# EAGLE design IN-14 Clock (EAGLE 8.1.0)
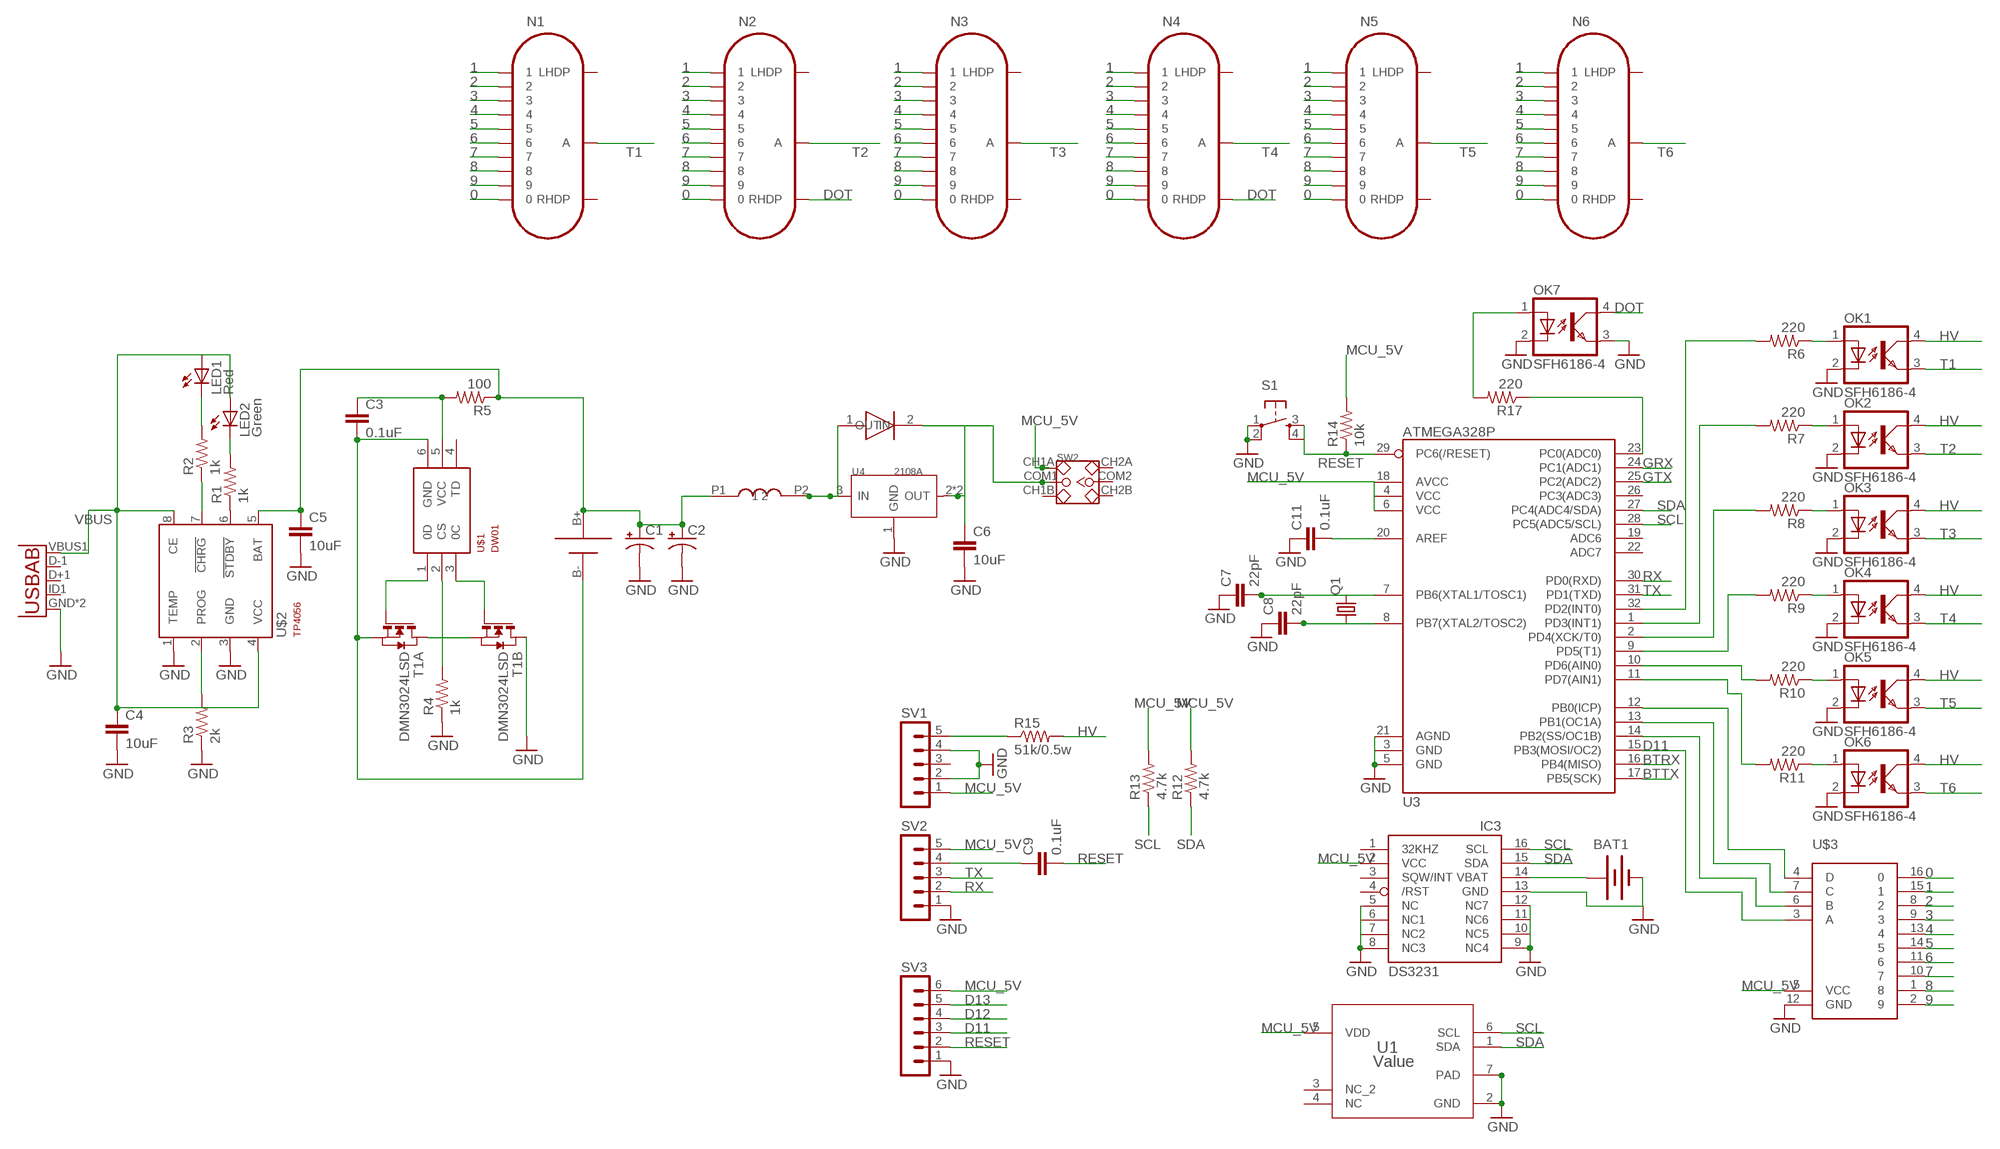
[diagram p0: schematic, sheet 1, part 1 of 2]
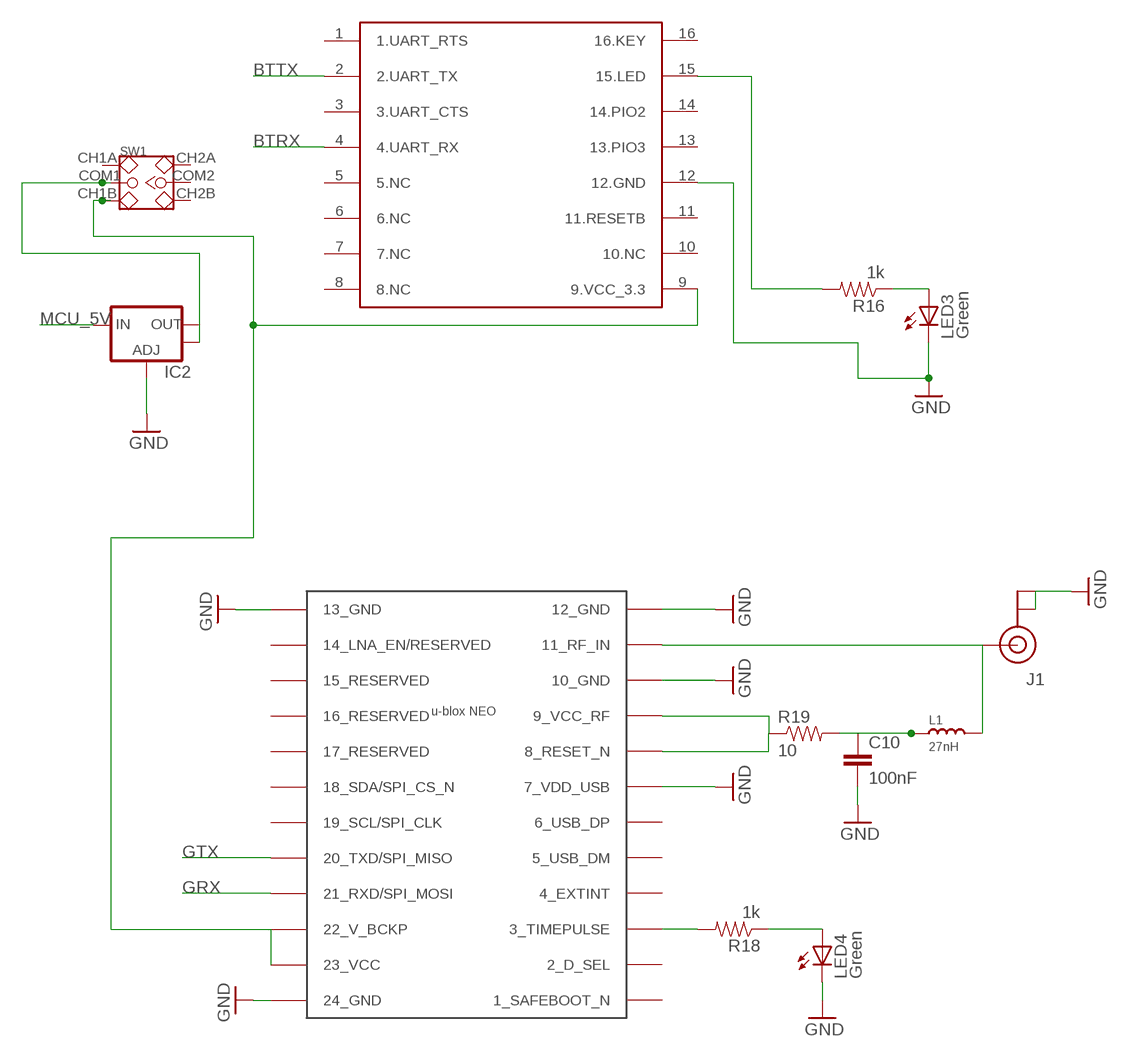
[diagram p1: schematic, sheet 1, part 2 of 2]

## Parts
BAT1  BATTERY20PTH  [BATTCOM_20MM_PTH]
C1  CAP_POLF80  [NIPPON_F80]
C2  CAP_POLF80  [NIPPON_F80]
C3  0.1uF  0.1UF-25V-5%(0603)  [0603-CAP]
C4  10uF  0.1UF-25V-5%(0603)  [0603-CAP]
C5  10uF  0.1UF-25V-5%(0603)  [0603-CAP]
C6  10uF  0.1UF-25V-5%(0603)  [0603-CAP]
C7  22pF  0.1UF-25V-5%(0603)  [0603-CAP]
C8  22pF  0.1UF-25V-5%(0603)  [0603-CAP]
C9  0.1uF  0.1UF-25V-5%(0603)  [0603-CAP]
C10  100nF  .22UF-CER  [0402-CAP]
C11  0.1uF  0.1UF-25V-5%(0603)  [0603-CAP]
IC2  V_REG_LM1117SOT223  [SOT223]
IC3  DS3231/SO  [SO16W]
J1  U.FL  [U.FL]
L1  27nH  SMD-FERRITE-BEAD-2500R-50MA(0603)  [L0603]
LED1  Red  LEDCHIP-LED0805  [CHIP-LED0805]
LED2  Green  LEDCHIP-LED0805  [CHIP-LED0805]
LED3  Green  LEDCHIP-LED0805  [CHIP-LED0805]
LED4  Green  LEDCHIP-LED0805  [CHIP-LED0805]
N1  IN-14  [IN-14]
N2  IN-14  [IN-14]
N3  IN-14  [IN-14]
N4  IN-14  [IN-14]
N5  IN-14  [IN-14]
N6  IN-14  [IN-14]
OK1  SFH6186-4  [SMD4-7]
OK2  SFH6186-4  [SMD4-7]
OK3  SFH6186-4  [SMD4-7]
OK4  SFH6186-4  [SMD4-7]
OK5  SFH6186-4  [SMD4-7]
OK6  SFH6186-4  [SMD4-7]
OK7  SFH6186-4  [SMD4-7]
Q1  CRYSTALSM49  [SM49]
R1  1k  1.2MOHMS-1/10W-1%(0603)  [0603-RES]
R2  1k  1.2MOHMS-1/10W-1%(0603)  [0603-RES]
R3  2k  1.2MOHMS-1/10W-1%(0603)  [0603-RES]
R4  1k  1.2MOHMS-1/10W-1%(0603)  [0603-RES]
R5  100  1.2MOHMS-1/10W-1%(0603)  [0603-RES]
R6  220  1.2MOHMS-1/10W-1%(0603)  [0603-RES]
R7  220  1.2MOHMS-1/10W-1%(0603)  [0603-RES]
R8  220  1.2MOHMS-1/10W-1%(0603)  [0603-RES]
R9  220  1.2MOHMS-1/10W-1%(0603)  [0603-RES]
R10  220  1.2MOHMS-1/10W-1%(0603)  [0603-RES]
R11  220  1.2MOHMS-1/10W-1%(0603)  [0603-RES]
R12  4.7k  1.2MOHMS-1/10W-1%(0603)  [0603-RES]
R13  4.7k  1.2MOHMS-1/10W-1%(0603)  [0603-RES]
R14  10k  1.2MOHMS-1/10W-1%(0603)  [0603-RES]
R15  51k/0.5w  R-US_0207/12  [0207/12]
R16  1k  1.2MOHMS-1/10W-1%(0603)  [0603-RES]
R17  220  1.2MOHMS-1/10W-1%(0603)  [0603-RES]
R18  1k  1.2MOHMS-1/10W-1%(0603)  [0603-RES]
R19  10  RESISTOR0603  [0603-RES]
S1  TAC_SWITCHSMD  [TACTILE_SWITCH_SMD]
SV1  MA05-1  [MA05-1]
SV2  MA05-1  [MA05-1]
SV3  MA06-1  [MA06-1]
SW1  SMD-TOGGLE-SWITCH-2CH(2X3P-7X3.5MM)  [SW6-2.54-SMD-7.0X3.5X1.5MM]
SW2  SMD-TOGGLE-SWITCH-2CH(2X3P-7X3.5MM)  [SW6-2.54-SMD-7.0X3.5X1.5MM]
T1  DMN3024LSD  [TSSOP-8]
U1  Value  HDC1080DMBR  [DMB0006A]
U2  USB""  [USB-MICRO-SMD]
U3  ATMEGA328P  ATMEGA328_SMT  [TQFP32-08]
U4  2108A  PMIC-CJA1117B-3.3(SOT-89)  [SOT-89]
U$1  DW01  [SOT23-6]
U$2  TP4056  [SOT23-8]
U$3  K155ID1  [DIL16-KIT]
U$5  22uH  CD54  [CD54]
U$6  SMA-SS34  [SMA-SS34]
U$7  18650SMD  [18650SMD]
U$8  NEO-M8  [NEO-M8]
U$9  HM-13  [HM-13]

## Nets
0: N1.0 N2.0 N3.0 N4.0 N5.0 N6.0 U$3.16
1: N1.1 N2.1 N3.1 N4.1 N5.1 N6.1 U$3.15
2: N1.2 N2.2 N3.2 N4.2 N5.2 N6.2 U$3.8
3: N1.3 N2.3 N3.3 N4.3 N5.3 N6.3 U$3.9
4: N1.4 N2.4 N3.4 N4.4 N5.4 N6.4 U$3.13
5: N1.5 N2.5 N3.5 N4.5 N5.5 N6.5 U$3.14
6: N1.6 N2.6 N3.6 N4.6 N5.6 N6.6 U$3.11
7: N1.7 N2.7 N3.7 N4.7 N5.7 N6.7 U$3.10
8: N1.8 N2.8 N3.8 N4.8 N5.8 N6.8 U$3.1
9: N1.9 N2.9 N3.9 N4.9 N5.9 N6.9 U$3.2
BTRX: U3.16(PB4(MISO)) U$9.4(4.UART_RX)
BTTX: U3.17(PB5(SCK)) U$9.2(2.UART_TX)
D11: SV3.3 U3.15(PB3(MOSI/OC2)) U$3.3(A)
D12: SV3.4
D13: SV3.5
DOT: N2.RHDP N4.RHDP OK7.4(COL)
GND: BAT1.2(-) C1.- C2.- C4.2 C5.2 C6.2 C7.1 C8.1 C10.2 C11.1 IC2.1(ADJ) IC3.5(NC) IC3.6(NC1) IC3.7(NC2) IC3.8(NC3) IC3.9(NC4) IC3.10(NC5) IC3.11(NC6) IC3.12(NC7) IC3.13(GND) J1.P$1(GND) J1.P$2(GND) LED3.C LED4.C OK1.2(C) OK2.2(C) OK3.2(C) OK4.2(C) OK5.2(C) OK6.2(C) OK7.2(C) OK7.3(EMIT) R3.1 R4.1 S1.1 S1.2 SV1.2 SV1.4 SV2.1 SV3.1 T1.8(B:D) U1.2(GND) U1.7(PAD) U2.GND U2.GND1(GND) U3.3(GND) U3.5(GND) U3.21(AGND) U4.1(GND) U$2.1(TEMP) U$2.3(GND) U$3.12(GND) U$8.7(7_VDD_USB) U$8.10(10_GND) U$8.12(12_GND) U$8.13(13_GND) U$8.24(24_GND) U$9.12(12.GND)
GRX: U3.24(PC1(ADC1)) U$8.21(21_RXD/SPI_MOSI)
GTX: U3.25(PC2(ADC2)) U$8.20(20_TXD/SPI_MISO)
HV: OK1.4(COL) OK2.4(COL) OK3.4(COL) OK4.4(COL) OK5.4(COL) OK6.4(COL) R15.2
MCU_5V: IC2.3(IN) IC3.2(VCC) R12.2 R13.2 R14.2 SV1.1 SV2.5 SV3.6 SW2.CH1A U1.5(VDD) U3.4(VCC) U3.6(VCC) U3.18(AVCC) U$3.5(VCC)
N$1: LED2.C R1.2
N$2: R1.1 U$2.6(!STDBY)
N$3: LED1.C R2.2
N$4: R2.1 U$2.7(!CHRG)
N$5: R3.2 U$2.2(PROG)
N$6: U4.3(IN) U$5.P2 U$6.1(IN)
N$7: C6.1 SW2.COM1 U4.2(OUT) U4.4(OUT) U$6.2(OUT)
N$8: T1.1(A:D) T1.6(B:S) T1.7(B:S)
N$9: T1.4(A:G) U$1.1(0D)
N$10: T1.5(B:G) U$1.3(0C)
N$11: R4.2 U$1.2(CS)
N$12: C3.2 T1.2(A:S) T1.3(A:S) U$1.6(GND) U$7.B-
N$13: C3.1 R5.2 U$1.5(VCC)
N$14: C1.+ C2.+ C5.1 R5.1 U$2.5(BAT) U$5.P1 U$7.B+
N$15: C7.2 Q1.2 U3.7(PB6(XTAL1/TOSC1))
N$16: C8.2 Q1.1 U3.8(PB7(XTAL2/TOSC2))
N$17: BAT1.1(+) IC3.14(VBAT)
N$18: C11.2 U3.20(AREF)
N$19: R15.1 SV1.5
N$20: R18.2 U$8.3(3_TIMEPULSE)
N$21: LED4.A R18.1
N$22: OK1.1(A) R6.1
N$23: OK2.1(A) R7.1
N$24: OK3.1(A) R8.1
N$25: OK4.1(A) R9.1
N$26: OK5.1(A) R10.1
N$27: OK6.1(A) R11.1
N$28: R6.2 U3.32(PD2(INT0))
N$29: R7.2 U3.1(PD3(INT1))
N$30: R8.2 U3.2(PD4(XCK/T0))
N$31: R9.2 U3.9(PD5(T1))
N$32: R10.2 U3.10(PD6(AIN0))
N$33: R11.2 U3.11(PD7(AIN1))
N$34: U3.12(PB0(ICP)) U$3.4(D)
N$35: U3.13(PB1(OC1A)) U$3.7(C)
N$36: U3.14(PB2(SS/OC1B)) U$3.6(B)
N$37: R17.1 U3.23(PC0(ADC0))
N$38: IC2.2(OUT) IC2.4(OUT) SW1.COM1
N$39: SW1.CH1B U$8.22(22_V_BCKP) U$8.23(23_VCC) U$9.9(9.VCC_3.3)
N$40: OK7.1(A) R17.2
N$41: C9.1 SV2.4
N$42: R16.2 U$9.15(15.LED)
N$43: LED3.A R16.1
N$44: C10.1 L1.1 R19.2
N$45: R19.1 U$8.8(8_RESET_N) U$8.9(9_VCC_RF)
N$47: J1.P$3(SIGNAL) L1.2 U$8.11(11_RF_IN)
RESET: C9.2 R14.1 S1.3 S1.4 SV3.2 U3.29(PC6(/RESET))
RX: SV2.2 U3.30(PD0(RXD))
SCL: IC3.16(SCL) R13.1 U1.6(SCL) U3.28(PC5(ADC5/SCL))
SDA: IC3.15(SDA) R12.1 U1.1(SDA) U3.27(PC4(ADC4/SDA))
T1: N1.A OK1.3(EMIT)
T2: N2.A OK2.3(EMIT)
T3: N3.A OK3.3(EMIT)
T4: N4.A OK4.3(EMIT)
T5: N5.A OK5.3(EMIT)
T6: N6.A OK6.3(EMIT)
TX: SV2.3 U3.31(PD1(TXD))
VBUS: C4.1 LED1.A LED2.A U2.VBUS1(VBUS) U$2.4(VCC) U$2.8(CE)
Unconnected: IC3.1(32KHZ) IC3.3(SQW/INT) IC3.4(/RST) N1.LHDP N1.RHDP N2.LHDP N3.LHDP N3.RHDP N4.LHDP N5.LHDP N5.RHDP N6.LHDP N6.RHDP SV1.3 SW1.CH1A SW1.CH2A SW1.CH2B SW1.COM2 SW2.CH1B SW2.CH2A SW2.CH2B SW2.COM2 U1.3(NC_2) U1.4(NC) U2.D+1(D+) U2.D-1(D-) U2.ID1(USBID) U3.19(ADC6) U3.22(ADC7) U3.26(PC3(ADC3)) U$1.4(TD) U$8.1(1_SAFEBOOT_N) U$8.2(2_D_SEL) U$8.4(4_EXTINT) U$8.5(5_USB_DM) U$8.6(6_USB_DP) U$8.14(14_LNA_EN/RESERVED) U$8.15(15_RESERVED) U$8.16(16_RESERVED) U$8.17(17_RESERVED) U$8.18(18_SDA/SPI_CS_N) U$8.19(19_SCL/SPI_CLK) U$9.1(1.UART_RTS) U$9.3(3.UART_CTS) U$9.5(5.NC) U$9.6(6.NC) U$9.7(7.NC) U$9.8(8.NC) U$9.10(10.NC) U$9.11(11.RESETB) U$9.13(13.PIO3) U$9.14(14.PIO2) U$9.16(16.KEY)

## Library data of the parts
BAT1 = SparkFun-Electromechanical:BATTERY: Battery Holders Various common sizes : AA, AAA, 20mm coin cell and 12mm coin cell. 20MM_4LEGS, BATT-10373
C1 C2 = SparkFun-Capacitors:CAP_POL: Capacitor Polarized These are standard SMD and PTH capacitors. Normally 10uF, 47uF, and 100uF in electrolytic and tantalum varieties. Always verify the external diameter of the through hole cap, it varies with capacity, voltage, and manufacturer. The EIA devices should be standard.
C3 C9 C11 = SparkFun-Capacitors:0.1UF-25V-5%(0603): CAP-08604; PROD_ID: CAP-08604
C4-C8 = SparkFun-Capacitors:0.1UF-25V-5%(0603): CAP-08604; PROD_ID: CAP-08604; VALUE: 0.1uF
C10 = SparkFun-Capacitors:.22UF-CER: .22uF ceramic SMT CAP-09885- 50V +80%/-20% (0603); PROD_ID: CAP-09885; VALUE: .22uF
IC2 = SparkFun-PowerIC:V_REG_LM1117: Voltage Regulator LM1117 Standard adjustable voltage regulator but in SMD form. Spark Fun Electronics SKU : COM-00595
IC3 = adafruit:DS3231
J1 = SparkFun-Connectors:U.FL: SMD antenna connector- WRL-09144; PROD_ID: CONN-09193
L1 = Seeed-OPL-Inductor:SMD-FERRITE-BEAD-2500R-50MA(0603): 303030020; VALUE: 2500R-50MA
LED1-LED4 = adafruit:LED: LED OSRAM: - CHIPLED LG R971, LG N971, LY N971, LG Q971, LY Q971, LO R971, LY R971 LH N974, LH R974 LS Q976, LO Q976, LY Q976 LO Q996 - Hyper CHIPLED LW Q18S LB Q993, LB Q99A, LB R99A - SideLED LS A670, LO A670, LY A670, LG A670, LP A670 LB A673, LV A673, LT A673, LW A673 LH A674 LY A675 LS A676, LA A676, LO A676, LY A676, LW A676 LS A679, LY A679, LG A679 - Hyper Micro SIDELED® LS Y876, LA Y876, LO Y876, LY Y876 LT Y87S - SmartLED LW L88C, LW L88S LB L89C, LB L89S, LG L890 LS L89K, LO L89K, LY L89K LS L896, LA L896, LO L896, LY L896 - TOPLED LS T670, LO T670, LY T670, LG T670, LP T670 LSG T670, LSP T670, LSY T670, LOP T670, LYG T670 LG T671, LOG T671, LSG T671 LB T673, LV T673, LT T673, LW T673 LH T674 LS T676, LA T676, LO T676, LY T676, LB T676, LH T676, LSB T676, LW T676 LB T67C, LV T67C, LT T67C, LS T67K, LO T67K, LY T67K, LW E67C LS E67B, LA E67B, LO E67B, LY E67B, LB E67C, LV E67C, LT E67C LW T67C LS T679, LY T679, LG T679 LS T770, LO T770, LY T770, LG T770, LP T770 LB T773, LV T773, LT T773, LW T773 LH T774 LS E675, LA E675, LY E675, LS T675 LS T776, LA T776, LO T776, LY T776, LB T776 LHGB T686 LT T68C, LB T68C - Hyper Mini TOPLED® LB M676 - Mini TOPLED Santana® LG M470 LS M47K, LO M47K, LY M47K Source: http://www.osram.convergy.de/
N1-N6 = russian-nixies:IN-14: IN-14: medium numeric frontview nixie tube
OK1-OK7 = optocoupler:SFH618?*: Optocoupler, Phototransistor Output, Low Input Current Source: Data sheet <http://www.vishay.com/docs/83673/sfh618.pdf>; MF: VISHAY/TELEFUNKEN; MPN: SFH6186-4; OC_FARNELL: 1469530; OC_NEWARK: 21H7753
Q1 = adafruit:CRYSTAL: CRYSTAL; OC_FARNELL: unknown; OC_NEWARK: unknown
R1-R14 R16-R18 = SparkFun-Resistors:1.2MOHMS-1/10W-1%(0603): RES-10055; PROD_ID: RES-10055; VALUE: 1.2M
R15 = resistor:R-US_: RESISTOR, American symbol
R19 = SparkFun-Resistors:RESISTOR: Resistor Basic schematic elements and footprints for 0603, 1206, and PTH resistors.
S1 = SparkFun-Electromechanical:TAC_SWITCH: Momentary Switch Button commonly used for reset or general input. Spark Fun Electronics SKU : COM-00097 SMT- SWCH-08247; PROD_ID: SWCH-08247
SV1 SV2 = con-lstb:MA05-1: PIN HEADER; OC_FARNELL: unknown; OC_NEWARK: unknown
SV3 = con-lstb:MA06-1: PIN HEADER; OC_FARNELL: unknown; OC_NEWARK: unknown
SW1 SW2 = Seeed-OPL-Switch:SMD-TOGGLE-SWITCH-2CH(2X3P-7X3.5MM): 311030005
T1 = FS8205A:DMN3024LSD: DUAL N-CHANNEL ENHANCEMENT MODE MOSFET data sheet <http://goo.gl/dRgboR> Dave.Calaway Eagle Library <https://goo.gl/Muy1Tr>
U1 = HDC1080:HDC1080DMBR; ALTERNATEPARTNUMBER: HDC1080DMBT; APPLICATION_BUILDNUMBER: *; COMPTYPE: IC; MANUFACTURER: Texas Instruments; MOUNTTYPE: SMT; PACKAGEREFERENCE: DMB0006A; PARTNUMBER: HDC1080DMBR; PIN_COUNT: 7; REFDES: RefDes; TYPE: TYPE
U2 = MicroUSB Long:USB: This is a USB AB connector that is compatible with USB OTG. i.e. this connector can serve as a host or device
U3 = SparkFun-DigitalIC:ATMEGA328_SMT: 32-Pin Atmega328 part Commonly used on Arduino compatible boards Available in QFP and QFN packages TQFP is IC-09069 QFN is non-stock; PROD_ID: IC-09069
U4 = Seeed-OPL-ic:PMIC-CJA1117B-3.3(SOT-89): 310030095; MPN: CJA1117B-3.3; VALUE: CJA1117B-3.3-SOT89
U$1 = DW01:DW01: The DW01-P battery protection IC is designed to protect lithium-ion/polymer battery from damage or degrading the lifetime due to overcharge, overdischarge, and/or overcurrent for one-cell lithium-ion/polymer battery powered systems, such as cellular phones. Data sheet <http://goo.gl/4y108d> Dave.Calaway Eagle Library <https://goo.gl/Muy1Tr>
U$2 = TP4056:TP4056: TP4056 Data sheet <http://goo.gl/J7k8TF> Dave.Calaway Eagle Library <https://goo.gl/Muy1Tr>
U$3 = Nixie:K155ID1
U$5 = CD54:CD54
U$6 = SMA-SS34:SMA-SS34
U$7 = 18650SMD:18650SMD
U$8 = ubloxLib:NEO-M8: u-blox NEO GNSS module
U$9 = HM-13:HM-13

## Board
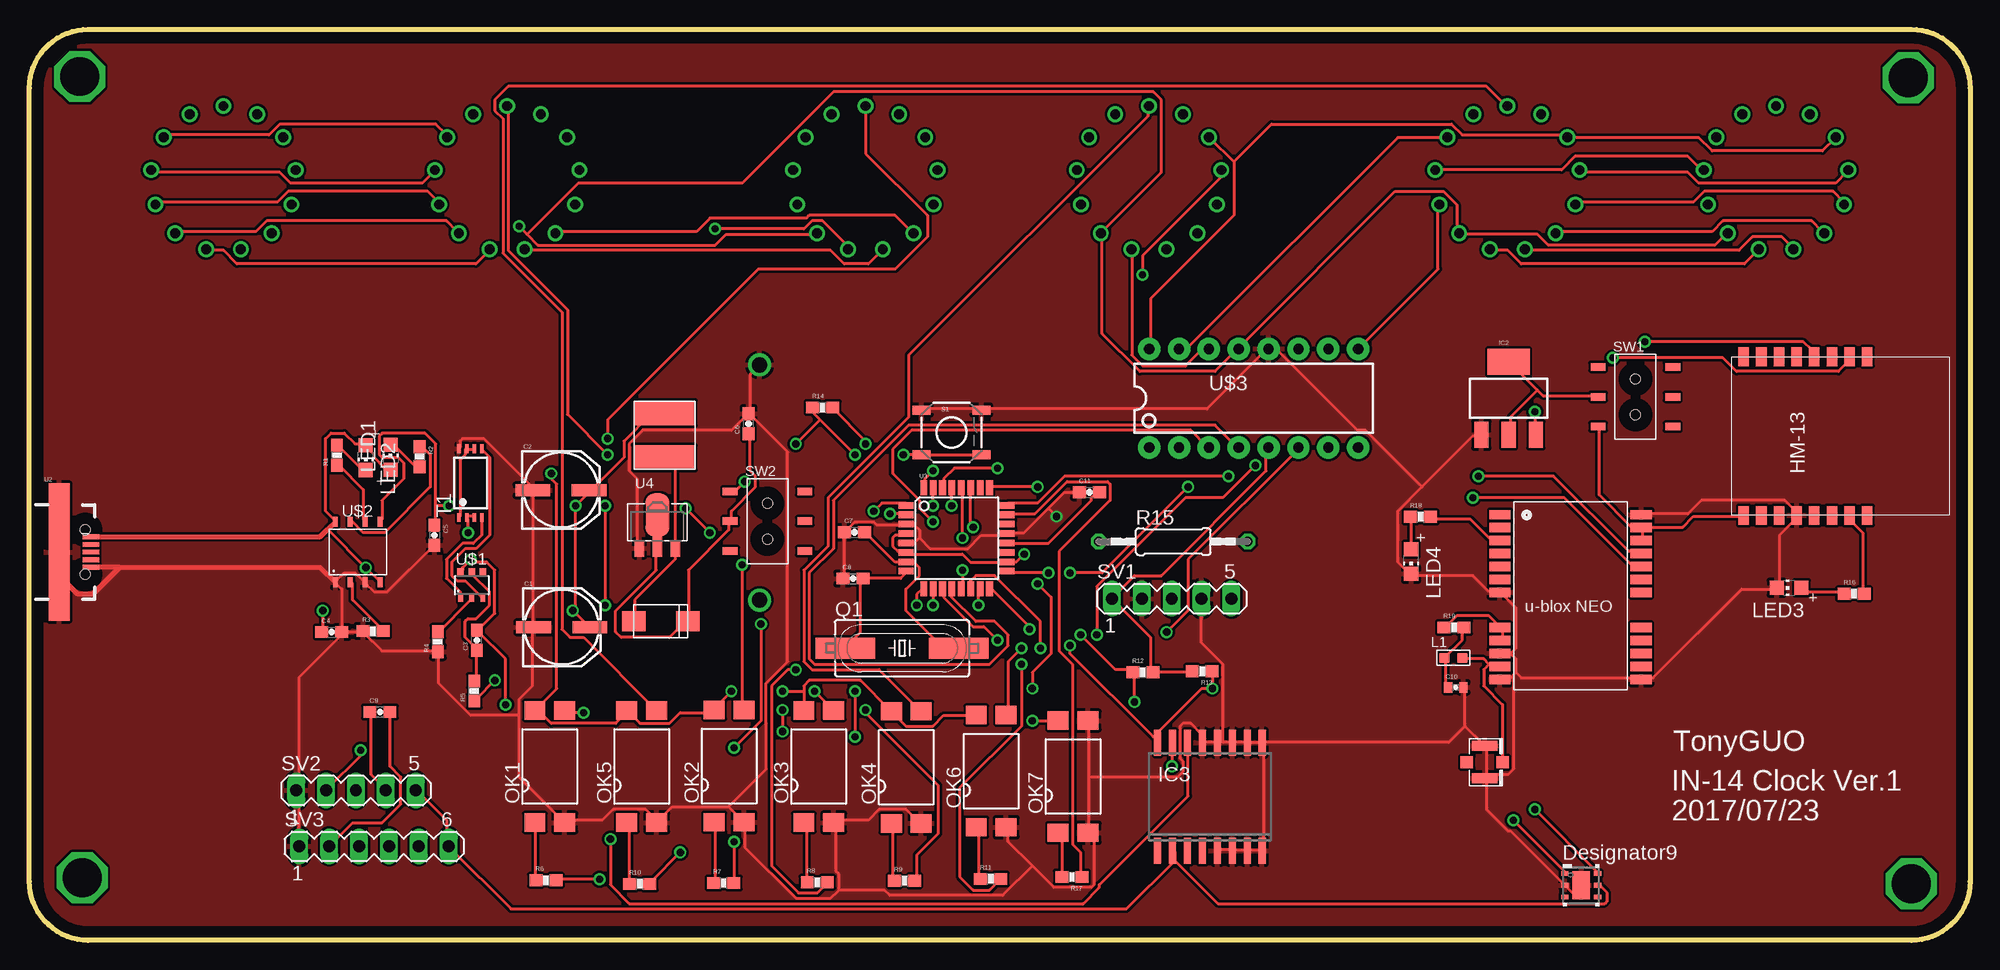
[diagram p2: board, top side]
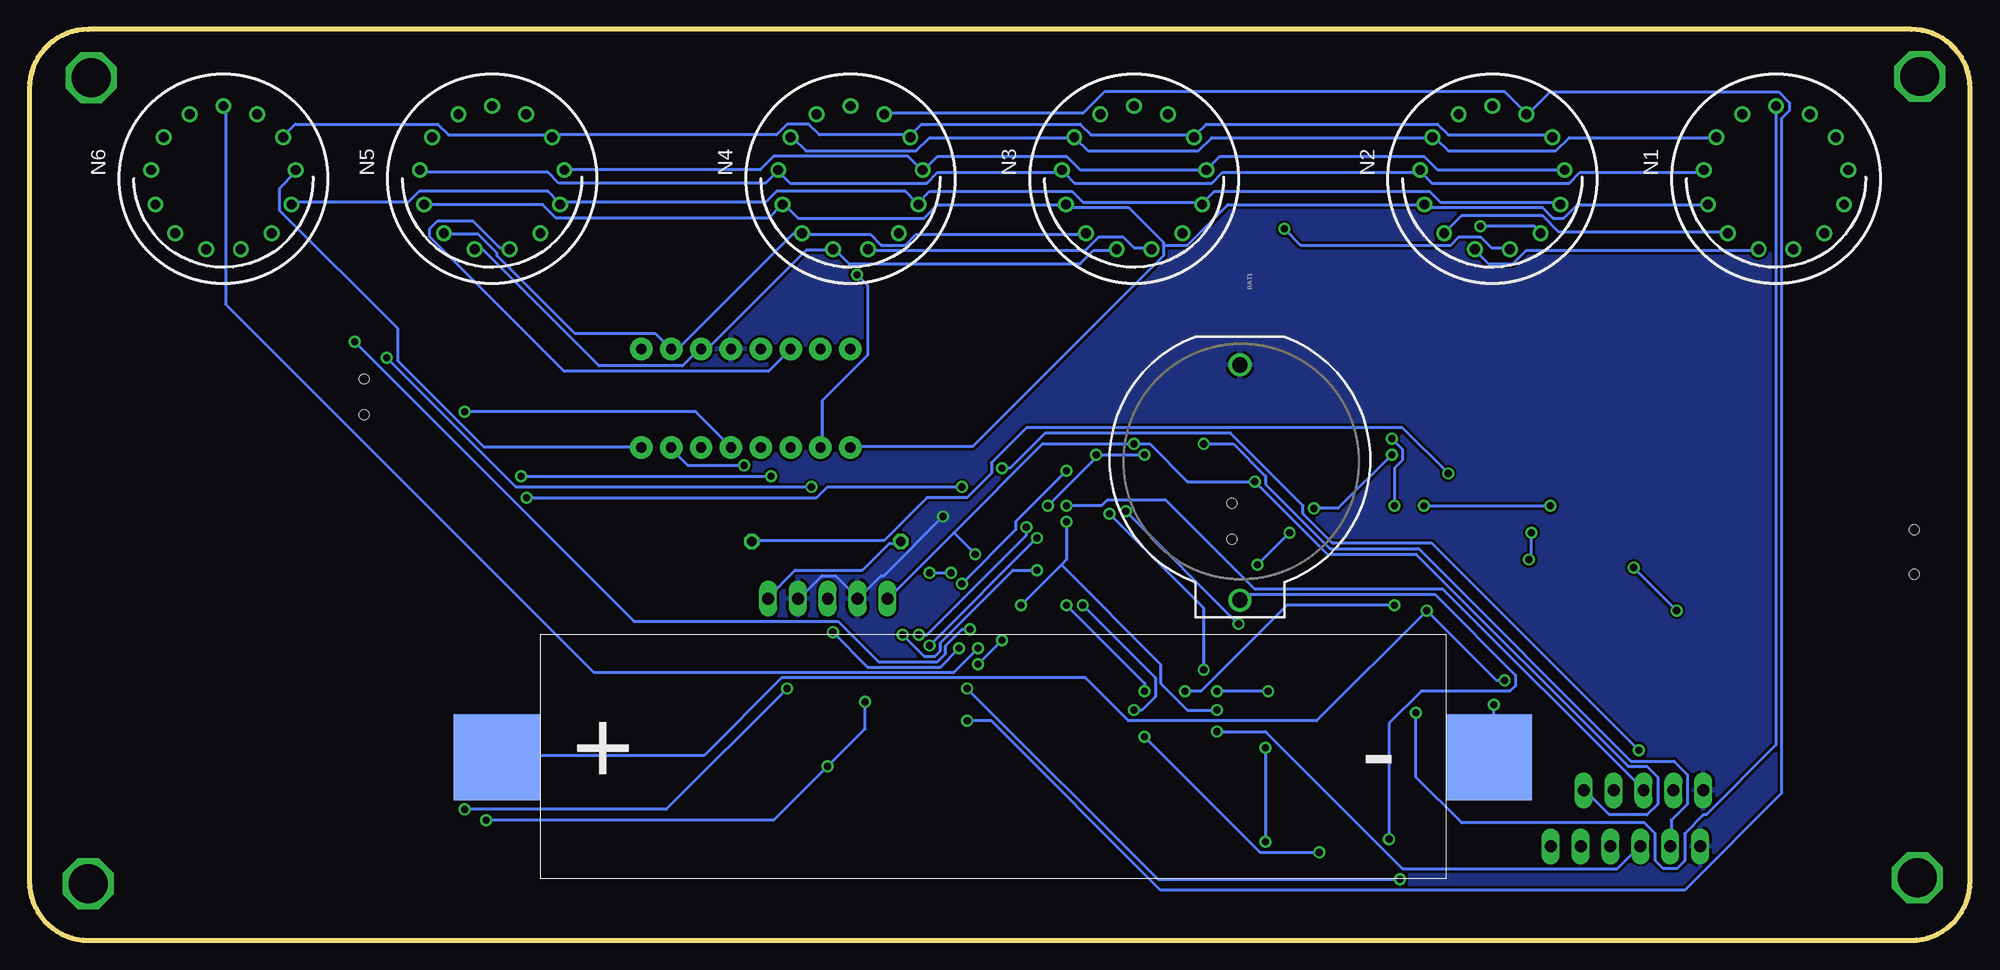
[diagram p3: board, bottom side, seen from below]

Size 165.1 x 77.47 mm. Coordinates in mm from the lower left corner, seen from the top.
Outline: 160.1,0 5,0 arc-90 0,5 0,72.47 arc-90 5,77.47 160.1,77.47 arc-90 165.1,72.47 165.1,5 arc-90 160.1,0
Copper layers (1*16): Top 0.035mm / dielectric 1.5mm / Bottom 0.035mm
Design rules "default": minimum track width 10mil, minimum drill 24mil, track to track 8mil, track to pad 8mil, pad to pad 8mil, via to via 8mil, smd to smd 8mil, copper to edge 40mil, drill to drill 8mil, minimum pad ring 10mil, minimum via ring 8mil, stop-mask expansion 4mil, vias tented up to drill 0mil, thermal gap 10mil

### Footprints (pad centres in the part's own frame; a part is rotated, then mirrored left to right if it is on the bottom)
BATTCOM_20MM_PTH = drill 1.3: 1 11.85,0; 2 -8.15,0
NIPPON_F80 = smd 2.95 x 1: + 2.4,0; - -2.4,0
0603-CAP = smd 1.1 x 1: 1 -0.85,0; 2 0.85,0
0402-CAP = smd 0.7 x 0.9: 1 -0.65,0; 2 0.65,0
SOT223 = smd 1.219 x 2.235: 1 -2.311,-3.099; 2 0,-3.099; 3 2.311,-3.099 | smd 3.6 x 2.2: 4 0,3.099
SO16W = smd 0.6 x 2.2: 1 -4.445,-4.6; 2 -3.175,-4.6; 3 -1.905,-4.6; 4 -0.635,-4.6; 5 0.635,-4.6; 6 1.905,-4.6; 7 3.175,-4.6; 8 4.445,-4.6; 9 4.445,4.6; 10 3.175,4.6; 11 1.905,4.6; 12 0.635,4.6; 13 -0.635,4.6; 14 -1.905,4.6; 15 -3.175,4.6; 16 -4.445,4.6
U.FL = smd 2.2 x 0.85: P$1 0,1.375; P$2 0,-1.375 | smd 1.05 x 1: P$3 1.525,0; P$4 -1.525,0
L0603 = smd 0.889 x 0.889: 1 -0.762,0; 2 0.762,0
CHIP-LED0805 = smd 1.2 x 1.2: A 0,-1.05; C 0,1.05
IN-14 = drill 0.84: 0 5.094,-3.516; 1 -5.094,-3.516; 2 -6.145,-0.746; 3 -5.788,2.195; 4 -4.105,4.633; 5 -1.481,6.01; 6 1.481,6.01; 7 4.105,4.633; 8 5.788,2.195; 9 6.145,-0.746; A 0,-6.19; LHDP 2.877,-5.481; RHDP -2.877,-5.481
SMD4-7 = smd 1.78 x 1.55: 1 -1.27,-4.77; 2 1.27,-4.77; 3 1.27,4.77; 4 -1.27,4.77
SM49 = smd 5.08 x 1.778: 1 -4.826,0; 2 4.826,0
0603-RES = smd 1.1 x 1: 1 -0.85,0; 2 0.85,0
0207/12 = drill 0.813 octagon: 1 -6.35,0; 2 6.35,0
TACTILE_SWITCH_SMD = smd 1.524 x 0.762: 1 -2.54,1.905; 2 2.54,1.905; 3 -2.54,-1.905; 4 2.54,-1.905
MA05-1 = drill 1.016 long: 1 -5.08,0; 2 -2.54,0; 3 0,0; 4 2.54,0; 5 5.08,0
MA06-1 = drill 1.016 long: 1 -6.35,0; 2 -3.81,0; 3 -1.27,0; 4 1.27,0; 5 3.81,0; 6 6.35,0
SW6-2.54-SMD-7.0X3.5X1.5MM = smd 1.27 x 0.635: CH1A -3.175,2.54; CH1B -3.175,-2.54; CH2A 3.175,2.54; CH2B 3.175,-2.54; COM1 -3.175,0; COM2 3.175,0 | hole 0.813: 0,1.524; 0,-1.524
TSSOP-8 = smd 0.3 x 0.75: 1 -0.975,-2.925; 2 -0.325,-2.925; 3 0.325,-2.925; 4 0.975,-2.925; 5 0.975,2.925; 6 0.325,2.925; 7 -0.325,2.925; 8 -0.975,2.925
DMB0006A = smd 0.6 x 0.4: 1 -1.4,1; 2 -1.4,0; 3 -1.4,-1; 4 1.4,-1; 5 1.4,0; 6 1.4,1 | smd 1.5 x 2.4: 7 0,0 | smd 0.5 x 0.5: V -0.5,0
USB-MICRO-SMD = smd 1.4 x 0.4: D+1 2.7,0; D-1 2.7,0.65; GND1 2.7,-1.3; ID1 2.7,-0.65; VBUS1 2.7,1.3 | smd 1.778 x 11.684: GND 0,0 | hole 0.85: 2.2,1.9; 2.2,-1.9
TQFP32-08 = smd 1.27 x 0.559: 1 -4.293,2.8; 2 -4.293,2; 3 -4.293,1.2; 4 -4.293,0.4; 5 -4.293,-0.4; 6 -4.293,-1.2; 7 -4.293,-2; 8 -4.293,-2.8; 17 4.293,-2.8; 18 4.293,-2; 19 4.293,-1.2; 20 4.293,-0.4; 21 4.293,0.4; 22 4.293,1.2; 23 4.293,2; 24 4.293,2.8 | smd 0.559 x 1.27: 9 -2.8,-4.293; 10 -2,-4.293; 11 -1.2,-4.293; 12 -0.4,-4.293; 13 0.4,-4.293; 14 1.2,-4.293; 15 2,-4.293; 16 2.8,-4.293; 25 2.8,4.293; 26 2,4.293; 27 1.2,4.293; 28 0.4,4.293; 29 -0.4,4.293; 30 -1.2,4.293; 31 -2,4.293; 32 -2.8,4.293
SOT-89 = smd 0.8 x 1.4: 1 -1.524,-1.905; 3 1.524,-1.905 | smd 0.8 x 1.9: 2 0,-1.651 | smd 2.032 x 3.65: 4 0,0.94
SOT23-6 = smd 0.4 x 0.55: 1 -0.95,-1.15; 2 0,-1.15; 3 0.95,-1.15 | smd 0.55 x 0.55: 4 0.95,1.15; 5 0,1.15; 6 -0.95,1.15
SOT23-8 = smd 0.42 x 0.835: 1 -1.905,-2.58; 2 -0.635,-2.58; 3 0.635,-2.58; 4 1.905,-2.58; 5 1.905,2.58; 6 0.635,2.58; 7 -0.635,2.58; 8 -1.905,2.58
DIL16-KIT = drill 0.864 pad 1.905: 1 -8.89,-4.191; 2 -6.35,-4.191; 3 -3.81,-4.191; 4 -1.27,-4.191; 5 1.27,-4.191; 6 3.81,-4.191; 7 6.35,-4.191; 8 8.89,-4.191; 9 8.89,4.191; 10 6.35,4.191; 11 3.81,4.191; 12 1.27,4.191; 13 -1.27,4.191; 14 -3.81,4.191; 15 -6.35,4.191; 16 -8.89,4.191
CD54 = smd 5.2 x 2.1: P1 2.6,-1; P2 2.6,-4.8
SMA-SS34 = smd 2 x 1.7: 1 0,-1.4; 2 4.6,-1.4
18650SMD = smd 7.3 x 7.3: B+ -3.7,10.3; B- 80.7,10.3
NEO-M8 = smd 1.8 x 0.8: 1 6.4,-7.4; 2 6.4,-6.3; 3 6.4,-5.2; 4 6.4,-4.1; 5 6.4,-3; 6 6.4,-1.9; 7 6.4,-0.8; 8 6.4,2.2; 9 6.4,3.3; 10 6.4,4.4; 11 6.4,5.5; 12 6.4,6.6; 13 -5.6,6.6; 14 -5.6,5.5; 15 -5.6,4.4; 16 -5.6,3.3; 17 -5.6,2.2; 18 -5.6,-0.8; 19 -5.6,-1.9; 20 -5.6,-3; 21 -5.6,-4.1; 22 -5.6,-5.2; 23 -5.6,-6.3; 24 -5.6,-7.4
HM-13 = smd 1.6 x 0.9: 1 0,11.5; 2 0,10; 3 0,8.5; 4 0,7; 5 0,5.5; 6 0,4; 7 0,2.5; 8 0,1; 9 13.5,1; 10 13.5,2.5; 11 13.5,4; 12 13.5,5.5; 13 13.5,7; 14 13.5,8.5; 15 13.5,10; 16 13.5,11.5

### Placement (x,y rotation side)
BAT1  62.12,40.78 270 bottom
C1  45.29,26.62 0 top
C2  45.22,38.28 0 top
C3  38.07,25.53 90 top
C4  25.73,26.21 0 top
C5  34.46,34.45 270 top
C6  61.18,43.94 90 top
C7  70.21,34.7 0 top
C8  70.06,30.76 0 top
C9  29.82,19.41 0 top
C10  121.34,21.51 0 top
C11  90.17,38.1 0 top
IC2  125.84,46.09 0 top
IC3  100.43,12.2 0 top
J1  123.8,15.15 0 top
L1  121.14,24.01 0 top
LED1  30.73,41.08 0 top
LED2  28.61,41.05 180 top
LED3  149.7,29.98 90 top
LED4  117.55,32.21 180 top
N1  16.51,64.77 180 bottom
N2  40.64,64.77 180 bottom
N3  71.12,64.77 180 bottom
N4  95.25,64.77 180 bottom
N5  125.73,64.77 180 bottom
N6  148.59,64.77 180 bottom
OK1  44.27,14.78 0 top
OK2  59.53,14.81 0 top
OK3  67.15,14.78 0 top
OK4  74.6,14.71 0 top
OK5  52.09,14.78 0 top
OK6  81.82,14.38 0 top
OK7  88.79,13.92 0 top
Q1  74.24,24.85 0 top
R1  26.17,41.25 90 top
R2  33.2,41.14 270 top
R3  29.23,26.3 0 top
R4  34.75,25.39 90 top
R5  37.85,21.2 90 top
R6  43.95,5.11 0 top
R7  59.06,4.87 0 top
R8  67.03,4.94 0 top
R9  74.45,5.07 0 top
R10  51.92,4.79 0 top
R11  81.77,5.22 0 top
R12  94.72,22.79 0 top
R13  99.77,22.88 180 top
R14  67.48,45.31 0 top
R15  97.31,33.91 0 top
R16  155.24,29.47 0 top
R17  88.69,5.38 180 top
R18  118.35,36.01 0 top
R19  121.19,26.61 0 top
S1  78.45,43.18 0 top
SV1  97.18,29.06 0 top
SV2  27.78,12.75 0 top
SV3  29.32,7.98 0 top
SW1  136.63,46.22 0 top
SW2  62.79,35.64 0 top
T1  37.53,38.88 0 top
U1  132.01,4.68 0 top
U2  2.54,33.02 0 top
U3  78.88,34.19 0 top
U4  53.43,35.24 0 top
U$1  37.63,30.21 0 top
U$2  27.94,33.02 0 top
U$3  104.15,46.1 0 top
U$5  51.44,45.85 0 top
U$6  51.41,28.53 0 top
U$7  121.64,5.27 0 bottom
U$8  131.51,28.79 180 top
U$9  144.84,49.63 270 top

### Tracks (layer width: path | path; a pad name or v marks a point on that pad's centre or on a via)
0
  Top 0.254: N6.0 153.67,68.28 152.53,67.13 143.15,67.13 142.01,68.28 131.04,68.28 N5.0 130.81,68.5 121.89,68.5 120.98,69.42 105.66,69.42 102.46,66.22 | 102.46,66.22 102.46,61.65 95.38,54.56 95.38,50.44 U$3.16 | 102.46,66.22 100.41,68.28 N4.0
  Bottom 0.254: N1.0 21.77,68.28 34.11,68.28 35.26,67.13 44.4,67.13 45.54,68.28 N2.0 45.77,68.28 64.52,68.28 65.66,67.13 75.03,67.13 76.17,68.28 N3.0 76.4,68.28 88.52,68.28 89.66,67.13 99.03,67.13 100.18,68.28 N4.0
1
  Top 0.254: U$3.15 97.89,50.44 98.58,50.44 116.41,68.28 120.52,68.28 N5.1 | N1.1 11.48,68.5 20.4,68.5 21.31,69.42 34.57,69.42 35.48,68.5 N2.1
  Bottom 0.254: N6.1 143.38,68.5 142.47,69.42 130.35,69.42 129.44,68.5 120.75,68.5 N5.1 120.52,68.5 101.55,68.5 100.63,69.42 98.81,69.42 97.89,68.5 90.35,68.5 N4.1 90.12,68.5 89.2,69.42 75.72,69.42 74.8,68.5 66.12,68.5 N3.1 65.89,68.5 64.97,69.42 45.31,69.42 44.4,68.5 35.71,68.5 N2.1
2
  Top 0.254: N5.2 119.61,65.53 130.35,65.53 131.5,66.67 141.1,66.67 142.24,65.53 N6.2 | N1.2 10.57,65.3 21.31,65.3 22.23,64.39 33.43,64.39 34.34,65.3 N2.2
  Bottom 0.254: U$3.8 113.21,41.99 126.47,41.99 133.78,49.3 133.78,52.05 143.84,62.1 143.84,63.93 142.47,65.3 N6.2 | N2.2 34.57,65.53 45.31,65.53 46.46,66.67 63.83,66.67 64.97,65.53 N3.2 65.2,65.53 75.72,65.53 76.86,66.67 87.83,66.67 88.98,65.53 N4.2 89.2,65.53 90.35,66.67 101.78,66.67 102.92,65.53 119.38,65.53 N5.2
3
  Top 0.254: N5.3 119.84,62.56 119.84,57.07 113.21,50.44 U$3.9 | N1.3 10.8,62.79 21.08,62.79 22,63.7 33.88,63.7 34.8,62.79 N2.3
  Bottom 0.254: N6.3 142.7,62.79 132.87,62.79 131.95,63.7 120.98,63.7 120.07,62.79 N5.3 119.84,62.79 102.46,62.79 101.55,63.7 90.58,63.7 89.66,62.79 N4.3 89.43,62.79 88.52,63.7 76.4,63.7 75.49,62.79 65.43,62.79 N3.3 65.2,62.79 64.29,63.7 46,63.7 45.09,62.79 35.03,62.79 N2.3
4  (via drill 0.61)
  Top 0.254: N1.4 12.62,60.27 19.25,60.27 20.17,61.19 35.48,61.19 36.4,60.27 N2.4 | v41.66,60.73 42.34,60.05 | 42.34,60.05 43.26,59.13 58.34,59.13 59.26,60.05 66.8,60.05 N3.4 | N6.4 144.3,60.05 143.38,59.13 129.21,59.13 128.3,60.05 121.67,60.05 N5.4 121.44,60.27 121.44,62.56 120.29,63.7 116.18,63.7 102.92,50.44 U$3.13 102.69,50.22 100.86,48.39 94.46,48.39 91.26,51.59 91.26,60.05 N4.4 91.26,60.27 96.29,65.3 96.29,71.48 95.61,72.16 68.4,72.16 60.63,64.39 46.69,64.39 42.34,60.05
  Bottom 0.254: v41.66,60.73 37.08,60.73 36.63,60.27 N2.4
5  (via drill 0.61)
  Top 0.254: N1.5 15.14,58.67 16.51,58.67 17.65,57.53 38,57.53 39.14,58.67 N2.5 | N5.5 124.41,58.67 125.78,58.67 126.92,57.53 145.9,57.53 147.04,58.67 N6.5 | U$3.14 100.18,50.22 99.72,50.22 98.35,48.84 94.69,48.84 93.78,49.76 93.78,58.67 N4.5 | v58.34,60.5 65.89,60.5 66.57,61.19 67.49,61.19 69.77,58.9 N3.5
  Bottom 0.254: N3.5 69.77,58.9 71.14,58.9 72.06,59.82 74.12,59.82 75.26,58.67 93.55,58.67 N4.5 | N5.5 124.41,58.9 125.09,58.9 127.38,61.19 130.35,61.19 131.04,60.5 131.04,59.82 119.61,48.39 102.23,48.39 100.41,50.22 U$3.14 | v58.34,60.5 56.97,59.13 44.17,59.13 43.48,59.82 41.66,59.82 40.74,58.9 39.37,58.9 N2.5
6
  Top 0.254: N5.6 127.38,58.67 145.44,58.67 146.58,59.82 149.1,59.82 150.01,58.9 N6.6 | N2.6 42.34,58.67 68.17,58.67 69.32,57.53 71.37,57.53 72.52,58.67 N3.6
  Bottom 0.254: N1.6 18.11,58.67 37.77,58.67 38.91,57.53 40.97,57.53 42.11,58.67 N2.6 | N3.6 72.75,58.67 74.57,58.67 75.72,57.53 95.38,57.53 96.52,58.67 N4.6 96.75,58.67 99.03,58.67 107.26,50.44 107.95,50.44 U$3.11 108.18,50.22 109.55,48.84 116.64,48.84 126.47,58.67 127.15,58.67 N5.6
7
  Top 0.254: N5.7 129.9,60.27 143.15,60.27 144.07,61.19 151.61,61.19 152.53,60.27 N6.7 | N2.7 44.86,60.27 56.74,60.27 57.89,61.42 66.12,61.42 66.34,61.65 73.66,61.65 75.03,60.27 N3.7
  Bottom 0.254: N1.7 20.62,60.27 35.03,60.27 36.4,61.65 43.26,61.65 44.63,60.27 N2.7 | N3.7 75.26,60.05 89.66,60.05 90.58,59.13 92.63,59.13 93.55,60.05 99.26,60.05 N4.7 99.49,60.05 100.18,60.05 109.78,50.44 110.47,50.44 U$3.10 110.69,50.44 111.84,51.59 118.69,51.59 125.32,58.22 125.32,58.45 126.92,60.05 129.67,60.05 N5.7
8
  Top 0.254: N5.8 131.72,62.79 141.55,62.79 142.47,63.7 153.44,63.7 154.36,62.79 N6.8
  Bottom 0.254: N1.8 22.45,62.56 33.43,62.56 34.57,61.42 35.48,61.42 36.4,62.33 46,62.33 46.23,62.56 N2.8 46.46,62.56 63.14,62.56 66.57,59.13 68.63,59.13 | 68.63,59.13 68.63,59.36 71.6,62.33 76.63,62.33 76.86,62.56 N3.8 77.09,62.56 87.83,62.56 88.98,61.42 99.72,61.42 100.86,62.56 N4.8 101.09,62.56 102.23,61.42 120.29,61.42 121.44,62.56 131.5,62.56 N5.8 | 68.63,59.13 68.63,58.22 84.86,41.99 95.15,41.99 U$3.1
9  (via drill 0.61)
  Top 0.254: N5.9 131.95,65.3 141.1,65.3 142.01,64.39 153.67,64.39 154.58,65.3 N6.9 | v94.69,56.62 94.69,58.22 101.32,64.85 101.32,65.3 N4.9
  Bottom 0.254: N1.9 22.68,65.3 33.2,65.3 34.11,64.39 45.77,64.39 46.69,65.3 N2.9 46.91,65.3 63.6,65.3 64.52,64.39 76.17,64.39 77.09,65.3 N3.9 77.32,65.3 87.83,65.3 88.75,64.39 100.41,64.39 101.32,65.3 N4.9 101.55,65.3 102.46,64.39 120.07,64.39 120.98,65.3 131.72,65.3 N5.9 | v94.69,56.62 93.78,55.7 93.78,49.76 97.66,45.87 97.66,41.99 U$3.2
BTRX  (via drill 0.61)
  Top 0.254: v85.09,26.44 85.09,26.67 81.89,29.87 U3.16 | v137.44,50.9 150.93,50.9 151.61,50.22 151.61,49.76 U$9.4
  Bottom 0.254: v85.09,26.44 85.78,26.44 87.15,25.07 87.15,24.38 87.83,23.7 92.86,23.7 96.29,27.13 113.66,27.13 v137.44,50.9
BTTX  (via drill 0.61)
  Top 0.254: v86.69,31.24 83.26,31.24 U3.17 | v88.52,31.24 91.26,31.24 v98.58,38.56 | v134.7,49.53 144.07,49.53 145.21,48.39 153.9,48.39 155.04,49.53 U$9.2
  Bottom 0.254: v88.52,31.24 v86.69,31.24 | v98.58,38.56 123.72,38.56 v134.7,49.53
D11  (via drill 0.61)
  Top 0.254: v80.75,28.5 80.75,29.87 U3.15 | v76.86,35.59 75.72,36.73 75.72,37.41 73.43,39.7 73.43,41.76 75.03,43.36 98.81,43.36 100.18,41.99 U$3.3 | v64.06,19.58 v64.06,17.75
  Bottom 0.254: 77.32,31.93 76.86,32.38 v76.86,35.59 | 77.32,31.93 v80.75,28.5 | v64.06,17.75 59.94,17.75 48.28,6.1 30,6.1 28.17,7.93 SV3.3 | v64.06,19.58 66.57,19.58 68.86,21.87 68.86,23.47 77.32,31.93
DOT  (via drill 0.61)
  Top 0.254: v85.32,18.67 87.38,18.67 OK7.4
  Bottom 0.254: v85.32,18.67 83.26,18.67 68.86,4.27 24.28,4.27 16.05,12.5 16.05,69.88 15.37,70.56 15.37,71.25 16.28,72.16 35.71,72.16 37.54,70.33 N2.RHDP 37.77,70.33 39.6,72.16 73.66,72.16 75.49,70.33 92.18,70.33 N4.RHDP
GND  (via drill 0.61)
  Top 0.254: SV3.1 22.91,8.15 22.91,12.72 SV2.1 22.91,12.95 22.91,22.33 26.57,25.98 C4.2 | C4.2 26.8,26.21 28.17,26.21 R3.1 28.4,26.21 30,24.61 34.57,24.61 R4.1 34.8,24.38 34.8,21.87 37.54,19.13 41.66,19.13 | C5.2 34.34,33.53 30.46,29.64 29.31,29.64 28.63,30.33 U$2.3 28.4,30.56 27.71,31.24 26.8,31.24 26.11,30.56 U$2.1 26.11,30.33 26.57,29.87 26.57,26.21 C4.2 | C6.2 61.32,44.96 61.32,48.16 62,48.84 BAT1.2 | U4.1 51.71,33.53 51.71,39.24 51.03,39.93 51.03,42.22 52.17,43.36 59.72,43.36 61.09,44.73 C6.2 | T1.8 36.63,41.99 36.63,42.44 36.86,42.67 38.68,42.67 43.03,38.33 C2.- 42.8,38.1 42.8,26.67 C1.- 42.8,26.44 42.8,21.64 41.66,20.5 41.66,19.13 | OK4.2 75.72,9.98 74.57,11.12 72.29,11.12 71.37,10.21 68.63,10.21 OK3.2 68.63,9.98 68.63,5.87 68.86,5.64 68.86,4.27 | 59.49,11.35 60.63,10.21 OK2.2 60.86,9.98 60.86,7.93 65.2,3.58 68.17,3.58 68.86,4.27 | 59.49,11.35 54.69,11.35 53.54,10.21 OK5.2 53.31,10.21 52.4,11.12 49.66,11.12 48.74,10.21 45.54,10.21 OK1.2 45.31,10.21 41.66,13.87 41.66,19.13 | 59.49,11.35 62.69,14.55 62.69,21.87 64.52,23.7 64.52,41.53 61.32,44.73 C6.2 | C11.1 88.06,38.1 86.69,36.73 | 86.69,36.73 84.63,34.67 83.26,34.67 U3.21 83.03,34.44 80.97,34.44 79.83,33.3 76.63,33.3 75.72,34.21 | 75.72,34.21 75.26,33.76 74.8,33.76 U3.5 | 75.72,34.21 75.72,34.9 75.26,35.36 74.8,35.36 U3.3 74.57,35.36 72.06,35.36 71.83,35.59 70.23,35.59 69.55,34.9 C7.1 69.32,34.67 69.32,30.79 C8.1 | 90.12,13.87 90.12,18.67 OK7.3 | 90.12,13.87 90.12,9.3 OK7.2 90.12,9.07 90.58,8.61 90.58,4.72 90.35,4.5 87.15,4.5 85.32,6.33 | 85.32,6.33 83.26,8.38 83.26,9.53 OK6.2 | IC3.5 101.09,7.7 102.23,7.7 IC3.6 102.46,7.7 103.38,7.7 IC3.7 103.61,7.7 104.75,7.7 IC3.8 104.98,7.7 104.98,16.61 IC3.9
  Top 0.254: IC3.9 104.75,16.84 103.61,16.84 IC3.10 103.38,16.84 102.46,16.84 IC3.11 102.23,16.84 101.55,16.84 | 101.55,16.84 101.09,16.84 IC3.12 100.86,16.84 99.95,16.84 IC3.13 99.72,16.84 99.72,17.53 98.81,18.44 98.12,18.44 97.89,18.21 97.89,15.47 98.12,15.24 98.12,14.33 97.66,13.87 90.12,13.87 | 101.55,16.84 101.55,23.47 99.72,25.3 99.72,28.96 SV1.4 | v87.38,36.04 86.69,36.73 | S1.1 75.95,45.19 80.97,45.19 S1.2 81.2,45.19 100.18,45.19 105.21,50.22 U$3.12 105.44,50.22 106.12,50.22 112.98,43.36 113.66,43.36 118.47,38.56 | U1.7 132.18,4.5 131.72,4.04 131.27,4.04 130.81,4.5 U1.2 130.58,4.72 126.01,9.3 125.78,9.3 123.95,11.12 123.95,13.64 J1.P$2 | 122.12,18.21 122.12,21.41 C10.2 | 122.12,18.21 123.72,16.61 J1.P$1 123.95,16.38 123.95,14.1 | 123.95,14.1 123.95,13.87 J1.P$2 | U$8.24 137.21,36.27 141.1,36.27 142.24,37.41 149.33,37.41 150.47,36.27 U$9.12 150.47,36.04 148.87,34.44 148.87,30.1 LED3.C 148.64,29.87 145.67,29.87 138.12,22.33 137.21,22.33 U$8.13 136.98,22.33 126.92,22.33 126.47,22.78 | 126.47,22.78 126.24,22.55 | 126.24,22.55 126.01,22.33 125.32,22.33 U$8.12 | 126.47,22.78 126.47,23.93 126.01,24.38 | 126.01,24.38 125.32,24.38 U$8.10 126.01,24.38 | 118.47,38.56 116.41,36.5 116.41,32.16 117.32,31.24 LED4.C 117.55,31.01 122.81,31.01 124.18,29.64 125.09,29.64 U$8.7 125.32,29.41 126.47,28.27 126.47,24.84 126.01,24.38 | 118.47,38.56 122.81,42.9 123.5,42.9 IC2.1 | 123.95,14.1 125.78,14.1 126.24,14.55 126.24,22.55 | 123.95,14.1 J1.P$2 | 122.12,18.21 120.75,16.84 104.98,16.84 IC3.9 | 68.86,4.27 72.75,4.27 73.2,3.81 82.8,3.81 85.32,6.33
  Top 0.406: 7.67,31.72 U2.GND1 | U$2.1 24.76,31.72 12.7,31.72 7.67,31.72 | 7.67,31.72 5.42,29.48 4.06,29.48 3.1,30.44 3.1,32.46 U2.GND
  Bottom 0.254: SV1.4 99.49,29.18 97.66,31.01 96.52,31.01 94.69,29.18 SV1.2 94.46,29.18 92.63,31.01 92.41,31.01 v87.38,36.04
  pour Bottom: -2.54,80.01 167.64,80.01 167.64,-3.81 -2.54,-3.81
  pour Top: 0,80.01 167.64,80.01 167.64,-3.81 -2.54,-3.81 -2.54,80.01
GRX  (via drill 0.61)
  Top 0.254: v102.01,39.47 88.06,39.47 85.78,37.19 83.26,37.19 U3.24 | v123.27,39.47 129.67,39.47 136.07,33.07 136.98,33.07 U$8.21
  Bottom 0.254: v123.27,39.47 v102.01,39.47
GTX  (via drill 0.61)
  Top 0.254: v85.78,38.56 81.89,38.56 U3.25 | v122.81,37.64 130.58,37.64 136.3,31.93 136.98,31.93 U$8.20
  Bottom 0.254: v85.78,38.56 97.21,38.56 98.12,37.64 v122.81,37.64
HV  (via drill 0.61)
  Top 0.254: OK6.4 80.52,19.13 77.78,19.13 76.86,18.21 74.57,18.21 73.43,19.36 OK4.4 73.2,19.58 70.69,22.1 66.34,22.1 65.89,21.64 65.89,21.18 | 65.89,21.18 65.89,19.58 OK3.4 | v44.4,39.7 44.4,39.24 44.86,38.79 44.86,21.41 43.03,19.58 OK1.4 43.03,19.36 43.48,19.36 44.4,18.44 49.89,18.44 50.8,19.36 OK5.4 51.03,19.36 51.94,18.44 54.46,18.44 55.37,19.36 58.12,19.36 OK2.4 58.12,19.58 v59.72,21.18 | v64.06,21.18 65.89,21.18
  Bottom 0.254: v44.4,39.7 48.28,43.59 80.29,43.59 83.26,40.62 83.26,39.7 85.32,37.64 88.75,37.64 92.41,33.98 103.61,33.98 R15.2 | v59.72,21.18 v64.06,21.18
MCU_5V  (via drill 0.61)
  Top 0.254: 97.43,6.78 101.09,3.12 134.01,3.12 134.24,3.35 134.24,4.04 133.78,4.5 133.55,4.5 U1.5 | 97.43,6.78 97.43,7.47 IC3.2 97.43,6.78 | v128.07,44.96 128.07,43.13 IC2.3 | SV2.5 32.97,12.72 35.48,10.21 35.48,8.15 SV3.6 35.71,7.93 40.97,2.67 93.32,2.67 97.43,6.78 | U3.4 74.57,34.44 73.66,34.44 73.43,34.21 73.43,33.53 73.89,33.07 74.57,33.07 U3.6 74.8,32.84 79.38,32.84 80.06,32.16 83.03,32.16 U3.18 83.26,32.16 83.95,32.16 v84.63,32.84 | R13.2 98.81,22.78 95.61,22.78 R12.2 95.38,23.01 95.38,25.76 92.18,28.96 SV1.1 92.18,29.18 94,31.01 96.29,31.01 105.21,39.93 105.21,41.76 U$3.5 | v71.14,42.22 71.14,42.44 68.4,45.19 R14.2 | v60.86,39.01 60.17,38.33 59.72,38.33 SW2.CH1A
  Bottom 0.254: v128.07,44.96 108.41,44.96 105.44,41.99 U$3.5 | 86.46,34.67 91.95,29.18 SV1.1 | 86.46,34.67 78.92,42.22 v71.14,42.22 69.77,42.22 66.57,39.01 v60.86,39.01 54.69,32.84 47.14,32.84 29.08,14.78 27.48,14.78 26.57,13.87 26.57,11.58 27.48,10.67 30.68,10.67 32.74,12.72 SV2.5 | 86.46,34.67 v84.63,32.84
N$1
  Top 0.254: R1.2 26.34,41.99 28.4,39.93 LED2.C
N$2
  Top 0.254: U$2.6 28.4,35.81 28.4,38.33 26.34,40.39 R1.1
N$3
  Top 0.254: R2.2 33.2,40.39 32.74,40.39 30.91,42.22 LED1.C
N$4
  Top 0.254: U$2.7 27.48,35.59 28.4,34.67 30.23,34.67 34.11,38.56 34.11,41.3 33.43,41.99 R2.1
N$5
  Top 0.254: U$2.2 27.48,30.33 27.48,28.96 30,26.44 R3.2
N$6
  Top 0.254: U$5.P2 54.23,40.84 54.92,40.16 54.92,33.53 U4.3 54.92,33.3 54.92,32.38 51.49,28.96 51.49,27.36 U$6.1
N$7
  Top 0.254: U4.4 53.54,36.04 53.54,33.76 U4.2 53.31,33.53 53.31,31.47 49.89,28.04 49.89,26.21 50.34,25.76 54.46,25.76 55.83,27.13 U$6.2 56.06,27.36 56.06,31.47 59.49,34.9 59.49,35.59 SW2.COM1 59.72,35.81 59.72,36.5 61.77,38.56 61.77,39.47 61.32,39.93 61.32,42.9 C6.1
N$8
  Top 0.254: T1.1 36.63,36.04 36.63,40.84 37.08,41.3 37.08,41.76 T1.7 37.31,41.76 37.77,41.76 T1.6
N$9
  Top 0.254: U$1.1 36.63,29.18 36.63,29.64 35.48,30.79 35.48,32.38 36.86,33.76 37.77,33.76 38.46,34.44 38.46,35.81 T1.4
N$10
  Top 0.254: U$1.3 38.46,29.18 37.08,30.56 36.4,30.56 35.94,31.01 35.94,32.16 37.08,33.3 38,33.3 39.14,34.44 39.14,41.07 38.46,41.76 T1.5
N$11
  Top 0.254: U$1.2 37.54,28.96 34.8,26.21 R4.2
N$12  (via drill 0.61)
  Top 0.254: T1.3 37.77,36.04 37.31,36.04 T1.2 37.31,35.81 v37.31,34.67 | 37.54,32.16 38.91,32.16 39.6,31.47 39.6,27.81 38.23,26.44 C3.2 38.23,26.21 40.51,23.93 v40.51,20.04 | 37.54,32.16 37.31,32.16 36.86,31.7 36.86,31.47 U$1.6 | 37.54,32.16 v37.54,32.38
  Bottom 0.254: v37.31,34.67 37.31,32.61 v37.54,32.38 | v40.51,20.04 40.51,15.93 40.74,15.7 U$7.B-
N$13
  Top 0.254: U$1.5 37.77,31.24 37.77,31.01 39.14,29.64 39.14,28.5 38,27.36 37.31,27.36 37.08,27.13 37.08,25.76 38,24.84 C3.1 38,24.61 38,22.1 R5.2
N$14  (via drill 0.61)
  Top 0.254: 34.57,36.96 34.57,35.36 C5.1 | 34.57,36.96 34.57,42.22 33.66,43.13 30,43.13 29.77,42.9 29.77,41.3 30,41.07 31.37,41.07 31.83,40.62 31.83,39.24 30,37.41 30,35.81 U$2.5 | U$5.P1 54,44.73 52.86,44.73 50.57,42.44 50.57,41.07 47.83,38.33 C2.+ 47.6,38.1 v46.46,36.96 46.46,27.81 | v35.71,36.96 34.57,36.96 | v39.6,22.1 38,20.5 R5.1 | 46.46,27.81 47.6,26.67 C1.+ | 46.46,27.81 v46.23,28.04
  Bottom 0.254: v46.46,36.96 v35.71,36.96 | v39.6,22.1 40.28,22.1 v46.23,28.04 55.6,18.67 71.6,18.67 75.26,22.33 101.09,22.33 107.72,15.7 125.32,15.7 U$7.B+
N$15
  Top 0.254: C7.2 71.14,34.67 73.66,32.16 74.57,32.16 U3.7 74.8,32.16 75.26,32.16 75.72,31.7 75.72,31.01 74.57,29.87 74.57,28.04 77.55,25.07 78.92,25.07 Q1.2
N$16
  Top 0.254: U3.8 74.57,31.24 74.12,30.79 70.92,30.79 C8.2 70.69,30.56 70.69,26.21 69.55,25.07 Q1.1
N$17  (via drill 0.61)
  Top 0.254: v49.43,8.61 49.43,4.72 51.03,3.12 89.66,3.12 91.03,4.5 91.03,4.72 98.58,12.27 98.58,16.61 IC3.14
  Bottom 0.254: v49.43,8.61 49.43,18.44 46.69,21.18 39.14,21.18 38.68,21.64 38.68,22.55 45.54,29.41 61.54,29.41 62,28.96 BAT1.1
N$18
  Top 0.254: C11.2 90.81,38.1 90.35,37.64 90.35,37.41 86.69,33.76 83.26,33.76 U3.20
N$19
  Bottom 0.254: R15.1 91.03,33.76 91.95,33.76 94.23,31.47 99.95,31.47 102.23,29.18 SV1.5
N$20
  Top 0.254: R18.2 119.38,35.81 122.58,35.81 124.18,34.21 125.09,34.21 U$8.3
N$21
  Top 0.254: R18.1 117.55,35.81 117.55,33.3 LED4.A
N$22
  Top 0.254: R6.1 43.03,5.18 43.03,9.98 OK1.1
N$23
  Top 0.254: R7.1 58.34,4.95 58.34,9.98 OK2.1
N$24
  Top 0.254: R8.1 66.12,4.95 66.12,9.75 65.89,9.98 OK3.1
N$25
  Top 0.254: R9.1 73.43,5.18 73.43,9.75 OK4.1
N$26
  Top 0.254: R10.1 51.03,4.95 51.03,9.98 OK5.1
N$27
  Top 0.254: R11.1 80.75,5.41 80.75,9.53 OK6.1
N$28  (via drill 0.61)
  Top 0.254: v48.51,5.18 44.86,5.18 R6.2 | v85.32,21.41 85.32,22.78 86.92,24.38 86.92,29.18 v85.78,30.33 | v76.86,39.93 76.17,39.24 76.17,38.56 U3.32
  Bottom 0.254: v48.51,5.18 69.09,5.18 v85.32,21.41 | v85.78,30.33 81.2,34.9 81.2,35.59 v76.86,39.93
N$29  (via drill 0.61)
  Top 0.254: v59.94,8.38 59.94,4.95 R7.2 | v59.94,16.38 62.23,18.67 v62.23,26.9 | v71.83,36.5 72.52,37.19 74.57,37.19 U3.1
  Bottom 0.254: v59.94,16.38 v59.94,8.38 | v71.83,36.5 v62.23,26.9
N$30  (via drill 0.61)
  Top 0.254: v65.2,23.01 64.52,23.01 63.14,21.64 63.14,6.33 65.43,4.04 67.03,4.04 67.72,4.72 R8.2 | v73.2,36.27 74.57,36.27 U3.2
  Bottom 0.254: v65.2,23.01 65.2,28.27 v73.2,36.27
N$31  (via drill 0.61)
  Top 0.254: v71.14,19.58 71.14,19.36 77.32,13.18 77.32,9.07 75.49,7.24 75.49,5.18 R9.2 | v75.49,28.5 75.49,29.41 75.95,29.87 U3.9
  Bottom 0.254: v71.14,19.58 70.46,19.58 69.32,20.73 69.32,22.33 v75.49,28.5
N$32  (via drill 0.61)
  Top 0.254: v55.37,7.47 52.86,4.95 R10.2 | v70.23,21.18 v70.23,17.3 | v76.86,28.5 76.86,29.87 U3.10
  Bottom 0.254: v55.37,7.47 60.4,7.47 v70.23,17.3 | v70.23,21.18 70.23,21.87 v76.86,28.5
N$33  (via drill 0.61)
  Top 0.254: v84.4,23.47 84.4,18.21 79.15,12.95 79.15,5.41 80.29,4.27 81.66,4.27 82.58,5.18 R11.2 | v82.35,25.53 81.2,26.67 80.29,26.67 77.78,29.18 77.78,29.87 U3.11
  Bottom 0.254: v82.35,25.53 v84.4,23.47
N$34
  Top 0.254: U3.12 78.46,29.87 78.46,29.18 80.52,27.13 82.12,27.13 83.26,25.98 83.26,25.07 81.66,23.47 66.8,23.47 66.34,23.93 66.34,31.24 68.4,33.3 68.4,37.41 74.8,43.82 100.86,43.82 102.69,41.99 U$3.4
N$35  (via drill 0.61)
  Top 0.254: v79.38,31.47 79.38,30.1 U3.13 | v90.81,25.98 90.81,30.1 98.35,37.64 101.55,37.64 v104.29,40.39
  Bottom 0.254: v79.38,31.47 81.43,31.47 87.61,25.3 87.61,24.61 88.06,24.15 88.98,24.15 v90.81,25.98 | v104.29,40.39 109.09,40.39 110.47,41.76 U$3.7
N$36  (via drill 0.61)
  Top 0.254: v86,24.84 86,27.13 82.12,31.01 80.52,31.01 80.06,30.56 80.06,30.1 U3.14 | v96.75,26.21 98.58,28.04 98.58,32.38 107.95,41.76 U$3.6
  Bottom 0.254: v86,24.84 87.61,23.24 93.78,23.24 v96.75,26.21
N$37
  Top 0.254: R17.1 89.43,5.41 89.43,7.47 88.75,8.15 88.75,23.47 87.61,24.61 87.61,33.07 91.95,37.41 91.95,38.79 91.72,39.01 88.29,39.01 85.55,36.27 83.26,36.27 U3.23
N$38
  Top 0.254: 128.3,46.79 126.01,49.07 IC2.4 | 128.3,46.79 128.75,46.33 133.33,46.33 SW1.COM1 | 128.3,46.79 126.01,44.5 126.01,43.13 IC2.2
N$39
  Top 0.254: SW1.CH1B 133.55,43.59 133.55,37.87 136.3,35.13 136.98,35.13 U$8.23 | U$9.9 145.67,36.04 141.55,36.04 140.64,35.13 137.21,35.13 U$8.23 | U$8.22 137.21,34.21 137.21,34.9 U$8.23
N$40
  Top 0.254: R17.2 87.83,5.41 87.83,8.84 87.61,9.07 OK7.1
N$41
  Top 0.254: C9.1 29.08,19.36 29.08,14.1 30.23,12.95 SV2.4
N$42
  Top 0.254: R16.2 155.96,29.64 155.96,34.67 155.04,35.59 155.04,36.04 U$9.15
N$43
  Top 0.254: R16.1 154.36,29.64 151.16,29.64 150.93,29.87 LED3.A
N$44
  Top 0.254: C10.1 120.52,21.64 120.52,23.93 L1.1 120.52,24.15 121.89,25.53 121.89,26.44 R19.2
N$45
  Top 0.254: R19.1 120.52,26.67 121.44,27.58 124.18,27.58 125.09,26.67 U$8.8 125.32,26.44 125.32,25.53 U$8.9
N$46  (via drill 3.3)
  other vias: 4.29,73.46
N$47
  Top 0.254: 124.18,23.47 123.72,23.93 122.12,23.93 L1.2 | 124.18,23.47 125.09,23.47 U$8.11 | 124.18,23.47 123.72,23.01 123.72,21.64 125.32,20.04 125.32,15.24 J1.P$3
N$48  (via drill 3.3)
  other vias: 159.84,73.36
N$49  (via drill 3.3)
  other vias: 160.09,4.81
N$50  (via drill 3.3)
  other vias: 4.49,5.31
RESET  (via drill 0.61)
  Top 0.254: C9.2 30.68,19.36 30.68,14.78 31.6,13.87 31.6,11.58 30,9.98 27.48,9.98 25.65,8.15 SV3.2 | v70.23,41.3 67.26,44.27 | 67.26,44.27 66.8,44.73 66.8,45.19 R14.1 | v74.35,41.3 75.72,41.3 S1.3 75.95,41.3 80.97,41.3 S1.4 | v78.46,36.96 78.46,38.33 U3.29 | 67.26,44.27 v65.2,42.22
  Bottom 0.254: 74.12,41.3 v70.23,41.3 | 74.12,41.3 v78.46,36.96 | 74.12,41.3 v74.35,41.3 | v65.2,42.22 62.69,42.22 59.94,39.47 59.94,38.79 54.46,33.3 46.91,33.3 28.85,15.24 25.2,15.24 24.05,14.1 24.05,11.58 25.43,10.21 25.43,8.15 SV3.2
RX  (via drill 0.61)
  Top 0.254: v82.35,40.16 78.69,40.16 77.78,39.24 77.78,38.56 U3.30 | v28.17,16.15 28.17,15.7 25.43,12.95 SV2.2
  Bottom 0.254: v82.35,40.16 81.66,40.16 78.69,43.13 62.92,43.13 56.74,36.96 56.74,36.27 54.23,33.76 45.77,33.76 v28.17,16.15
SCL  (via drill 0.61)
  Top 0.254: v79.38,34.21 79.38,38.33 U3.28 | v88.52,25.07 88.52,24.38 95.61,17.3 | 95.61,17.3 96.06,16.84 IC3.16 | v128.07,11.12 133.33,5.87 U1.6 | R13.1 100.63,22.78 v100.63,21.41 99.72,21.41 95.61,17.3
  Bottom 0.254: v88.52,25.07 v79.38,34.21 | v128.07,11.12 110.92,11.12 v100.63,21.41
SDA  (via drill 0.61)
  Top 0.254: v126.24,10.21 130.58,5.87 U1.1 | v97.21,14.78 97.21,16.61 IC3.15 | v94,20.27 94,22.78 R12.1 93.78,23.01 92.41,23.01 v89.43,25.98 | v80.29,35.13 80.06,35.36 80.06,38.33 U3.27
  Bottom 0.254: v126.24,10.21 101.78,10.21 v97.21,14.78 94,17.98 v94,20.27 | v80.29,35.13 80.29,34.44 88.75,25.98 v89.43,25.98
T1  (via drill 0.61)
  Top 0.254: v47.14,19.36 45.54,19.36 OK1.3
  Bottom 0.254: v47.14,19.36 47.14,13.87 43.26,9.98 27.71,9.98 26.8,9.07 26.8,6.78 26.11,6.1 24.97,6.1 24.28,6.78 24.28,9.07 22.68,10.67 22.45,10.67 16.51,16.61 N1.A
T2  (via drill 0.61)
  Top 0.254: v60.63,31.93 60.63,19.58 OK2.3 | v55.83,36.73 v57.89,34.67 | v49.2,41.3 45.77,44.73 45.77,53.65 40.74,58.67 40.74,70.79 N2.A
  Bottom 0.254: v57.89,34.67 v60.63,31.93 | v55.83,36.73 53.77,36.73 v49.2,41.3
T3  (via drill 0.61)
  Top 0.254: v66.8,21.18 68.4,19.58 OK3.3 | v48.97,36.96 v48.97,28.5 | v49.2,42.67 49.2,44.27 62,57.07 73.66,57.07 76.4,59.82 76.4,61.65 71.14,66.9 71.14,70.79 N3.A
  Bottom 0.254: v66.8,21.18 65.43,21.18 58.12,28.5 v48.97,28.5 | v48.97,36.96 48.97,40.16 48.28,40.84 48.28,41.76 v49.2,42.67
T4
  Top 0.254: OK4.3 75.72,19.58 72.29,23.01 66.57,23.01 65.89,23.7 65.89,31.47 67.95,33.53 67.95,37.64 74.8,44.5 74.8,49.76 95.15,70.1 95.15,70.79 N4.A
T5
  Top 0.254: OK5.3 53.31,19.58 47.14,25.76 46,25.76 45.31,26.44 45.31,53.42 40.28,58.45 40.28,69.88 39.6,70.56 39.6,71.48 40.74,72.62 123.95,72.62 125.55,71.02 N5.A
T6  (via drill 0.61)
  Top 0.254: v84.4,24.84 83.26,23.7 83.26,19.36 OK6.3
  Bottom 0.254: v84.4,24.84 86.46,22.78 117.09,22.78 148.41,54.1 148.41,70.79 N6.A
TX  (via drill 0.61)
  Top 0.254: v76.86,36.96 76.86,38.33 U3.31
  Bottom 0.254: v76.86,36.96 73.89,36.96 73.43,37.41 68.4,37.41 60.86,29.87 44.86,29.87 27.94,12.95 SV2.3
VBUS  (via drill 0.61)
  Top 0.254: LED1.A 30.68,40.16 30.23,40.16 29.31,41.07 29.31,41.3 28.63,41.99 LED2.A 28.4,42.22 27.71,42.22 26.8,43.13 25.65,43.13 25.2,42.67 25.2,36.5 25.88,35.81 U$2.8 | 25.38,34.95 v28.63,31.7 29.77,30.56 U$2.4 | v24.97,28.04 24.97,26.21 C4.1
  Top 0.406: U2.VBUS1 24.76,34.32 25.38,34.95 U$2.8
  Bottom 0.254: v28.63,31.7 v24.97,28.04

### Text on the board
tPlace: TonyGUO | IN-14 Clock Ver.1 | 2017/07/23